# Altium schematic sheet Alimentation.SchDoc
size A3; Organization: Altium Limited; Address1: Laboratoire de Systèmes Embarqués; Address2: 7, rue de la Serre; Address3: 2610 Saint-Imier / Switzerland; PageSetup: Record=PageOptions|CenterHorizontal=True|CenterVertical=True|PrintScale=0.24|XCorrection=1.00|YCorrection=1.00|PrintKind=0|BorderSize=5000000|LeftOffset=0|BottomOffset=0|Orientation=2|PaperLength=1000|PaperWidth=1000|Scale=100|PaperSource=7|PrintQuality=-4|MediaType=1|DitherType=10|PaperKind=A4|PrintScaleMode=1
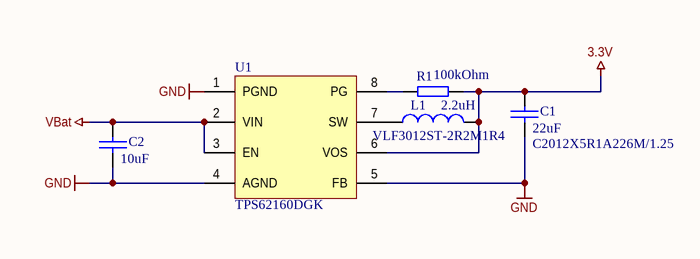
[diagram p0: Alimentation.SchDoc]

## Parts
C1  C2012X5R1A226M/1.25  value 22uF  [080501]
C2  value 10uF  [080501]  (hidden comment: GRM21BR61E106KA73L)
L1  VLF3012ST-2R2M1R4  value 2.2uH  [080503]
R1  value 100kOhm  [080501]  (hidden comment: ERJ-6GEYJ104V)
U1  TPS62160DGK  [TSOP65P490-8AM]

## Nets
3.3V: C1.1 L1.2 R1.2 U1.6(VOS)
GND: C1.2 C2.2 U1.1(PGND) U1.4(AGND) U1.5(FB)
VBat: C2.1 U1.2(VIN) U1.3(EN)
NetL1_1: L1.1 U1.7(SW)
NetR1_1: R1.1 U1.8(PG)

## Notes on the sheet
- Title
- Size:
- Date:
- A3
- Author:
- Time:
- Revision:
- Sheet
- of
- File:

## Library data of the parts
C1 C2 = CAPA: EtatCommande: Interne; Text Field1: CAPA; Supplier 1: Digi-Key
  C1: Supplier Part Number 1: 445-7665-1-ND
  C2: Supplier Part Number 1: 490-5523-1-ND
L1 = INDUCTOR: EtatCommande: Commandé; Text Field1: INDUCTOR; Supplier 1: Digi-Key; Supplier Part Number 1: 445-4200-1-ND
R1 = RES: Text Field1: RESISTANCE; EtatCommande: Interne; Supplier 1: Digi-Key; Supplier Part Number 1: P100KACT-ND
U1 = TPS62160: IC BUCK SYNC ADJ 1A 8MSOP; EtatCommande: Commandé; Part Name: TPS62160DGK; Supplier 1: Digi-Key; Supplier Part Number 1: 296-30318-1-ND